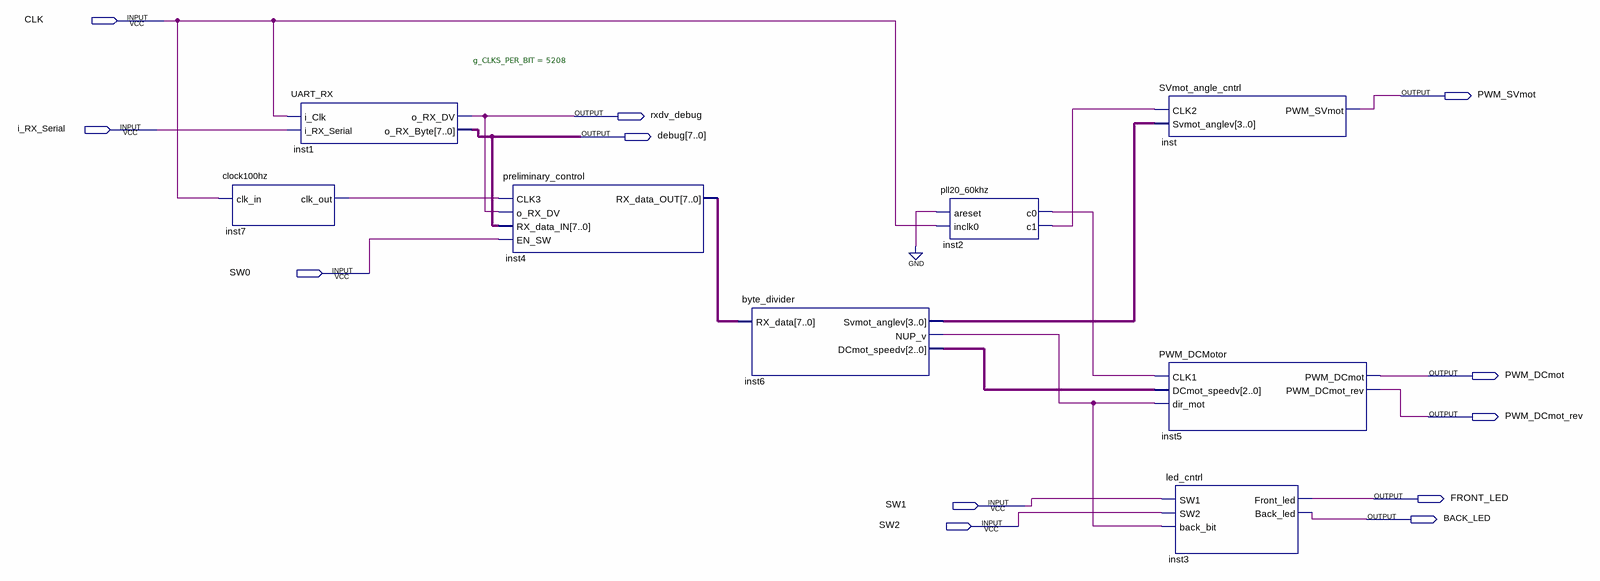
[diagram p0: schematic sheet]
// Quartus schematic Main.bdf as structural Verilog: 8 symbols, 12 pins
module Main (
  input  CLK,
  input  i_RX_Serial,
  input  SW0,
  input  SW1,
  input  SW2,
  output PWM_SVmot,
  output rxdv_debug,
  output [7:0] debug,
  output PWM_DCmot,
  output PWM_DCmot_rev,
  output FRONT_LED,
  output BACK_LED
);

  wire inst2_c0, inst2_c1, inst6_nup_v, inst7_clk_out;
  wire [2:0] inst6_dcmot_speedv;
  wire [3:0] inst6_svmot_anglev;
  wire [7:0] inst4_rx_data_out;

  clock100hz inst7 (.clk_in(CLK), .clk_out(inst7_clk_out));
  UART_RX #(.g_CLKS_PER_BIT(5208)) inst1 (
    .i_Clk(CLK), .i_RX_Serial(i_RX_Serial), .o_RX_DV(rxdv_debug), .o_RX_Byte(debug));
  preliminary_control inst4 (
    .CLK3(inst7_clk_out), .o_RX_DV(rxdv_debug), .RX_data_IN(debug), .EN_SW(SW0),
    .RX_data_OUT(inst4_rx_data_out));
  byte_divider inst6 (
    .RX_data(inst4_rx_data_out), .Svmot_anglev(inst6_svmot_anglev), .NUP_v(inst6_nup_v),
    .DCmot_speedv(inst6_dcmot_speedv));
  pll20_60khz inst2 (.areset(1'b0), .inclk0(CLK), .c0(inst2_c0), .c1(inst2_c1));
  SVmot_angle_cntrl inst (.CLK2(inst2_c1), .Svmot_anglev(inst6_svmot_anglev), .PWM_SVmot(PWM_SVmot));
  PWM_DCMotor inst5 (
    .CLK1(inst2_c0), .DCmot_speedv(inst6_dcmot_speedv), .dir_mot(inst6_nup_v), .PWM_DCmot(PWM_DCmot),
    .PWM_DCmot_rev(PWM_DCmot_rev));
  led_cntrl inst3 (.SW1(SW1), .SW2(SW2), .back_bit(inst6_nup_v), .Front_led(FRONT_LED), .Back_led(BACK_LED));
endmodule
